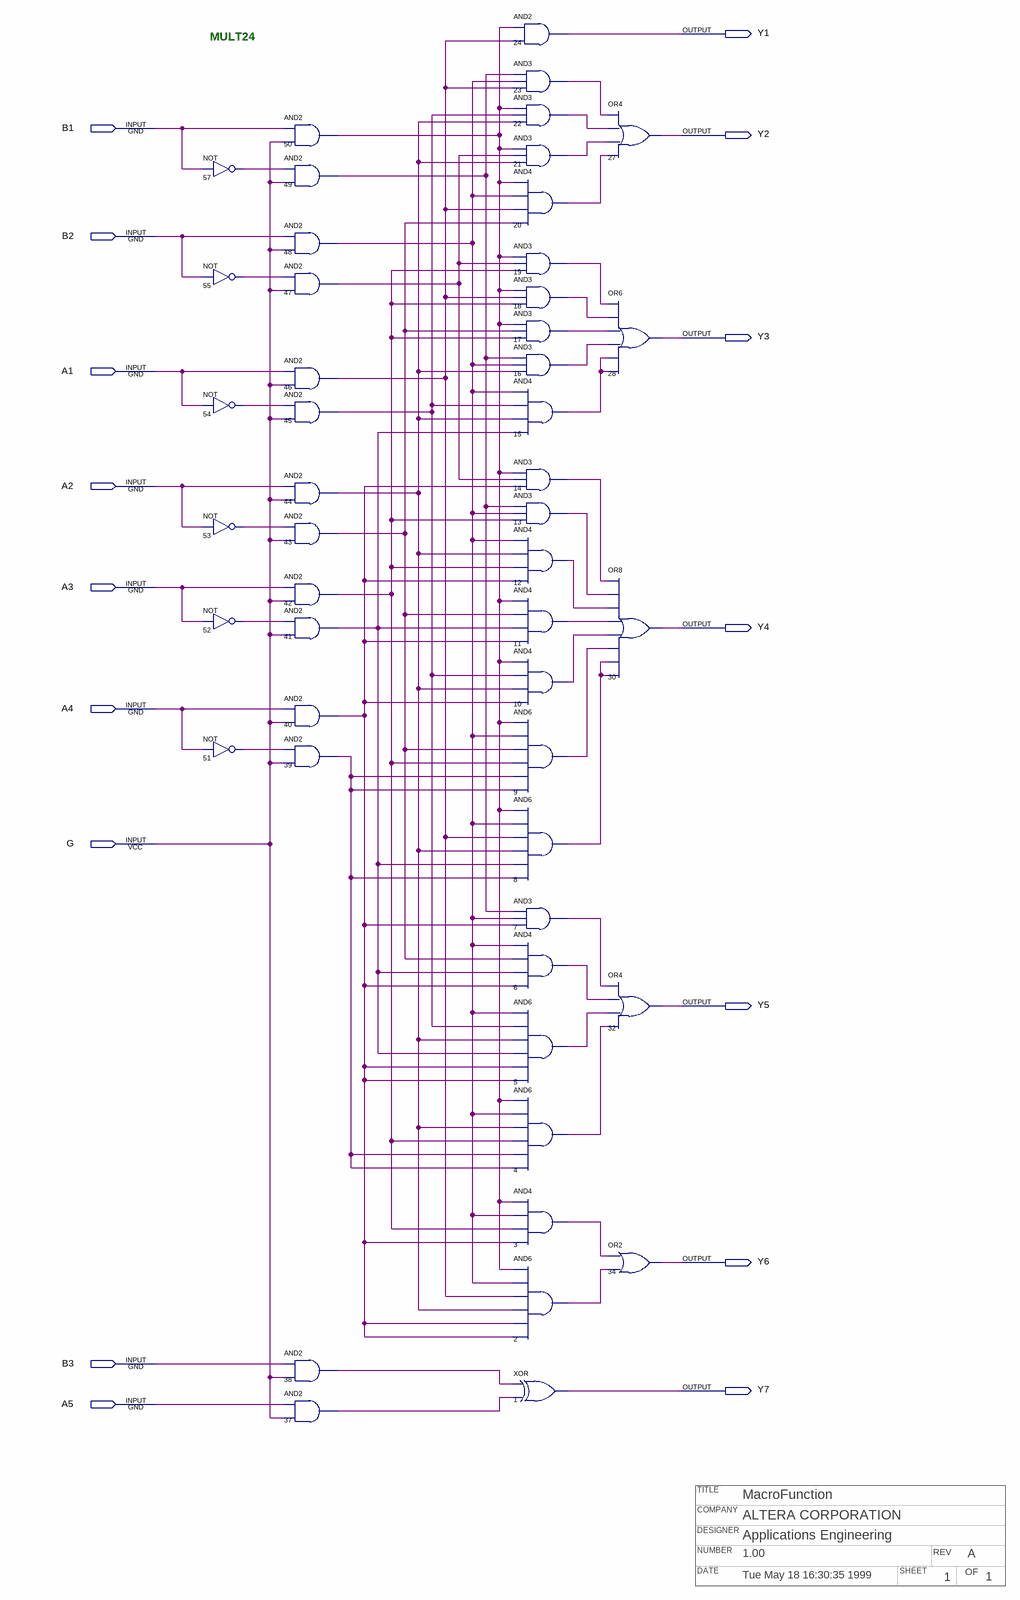
[diagram p0: schematic sheet]
// Quartus schematic mult24.bdf as structural Verilog: 49 symbols, 16 pins
// Title block: TITLE: MacroFunction; COMPANY: ALTERA CORPORATION; DESIGNER: Applications Engineering; NUMBER: 1.00; REV: A; DATE: Tue May 18 16:30:35 1999; SHEET: 1; OF: 1
module mult24 (
  input  B1,
  input  B2,
  input  A1,
  input  A2,
  input  A3,
  input  A4,
  input  G,
  input  B3,
  input  A5,
  output Y1,
  output Y2,
  output Y3,
  output Y4,
  output Y5,
  output Y6,
  output Y7
);

  wire n2_out, n3_out, n4_out, n5_out, n6_out, n7_out, n8_out, n9_out, n10_out, n11_out, n12_out, n13_out,
       n14_out, n15_out, n16_out, n17_out, n18_out, n19_out, n20_out, n21_out, n22_out, n23_out, n37_out,
       n38_out, n39_out, n40_out, n41_out, n42_out, n43_out, n44_out, n45_out, n46_out, n47_out, n48_out,
       n49_out, n50_out, n51_out, n52_out, n53_out, n54_out, n55_out, n57_out;

  not u_57 (n57_out, B1);
  not u_55 (n55_out, B2);
  not u_54 (n54_out, A1);
  not u_53 (n53_out, A2);
  not u_52 (n52_out, A3);
  not u_51 (n51_out, A4);
  and u_50 (n50_out, B1, G);
  and u_49 (n49_out, n57_out, G);
  and u_48 (n48_out, B2, G);
  and u_47 (n47_out, n55_out, G);
  and u_46 (n46_out, A1, G);
  and u_45 (n45_out, n54_out, G);
  and u_44 (n44_out, A2, G);
  and u_43 (n43_out, n53_out, G);
  and u_42 (n42_out, A3, G);
  and u_41 (n41_out, n52_out, G);
  and u_40 (n40_out, A4, G);
  and u_39 (n39_out, n51_out, G);
  and u_38 (n38_out, B3, G);
  and u_37 (n37_out, A5, G);
  and u_24 (Y1, n50_out, n46_out);
  and u_23 (n23_out, n49_out, n48_out, n46_out);
  and u_22 (n22_out, n50_out, n45_out, n44_out);
  and u_21 (n21_out, n50_out, n47_out, n44_out);
  and u_20 (n20_out, n50_out, n48_out, n46_out, n43_out);
  and u_19 (n19_out, n50_out, n47_out, n42_out);
  and u_18 (n18_out, n50_out, n46_out, n42_out);
  and u_17 (n17_out, n50_out, n43_out, n42_out);
  and u_16 (n16_out, n49_out, n48_out, n44_out);
  and u_15 (n15_out, n48_out, n45_out, n44_out, n41_out);
  and u_14 (n14_out, n50_out, n47_out, n40_out);
  and u_13 (n13_out, n49_out, n48_out, n42_out);
  and u_12 (n12_out, n48_out, n44_out, n42_out, n40_out);
  and u_11 (n11_out, n50_out, n43_out, n41_out, n40_out);
  and u_10 (n10_out, n50_out, n45_out, n44_out, n40_out);
  and u_9 (n9_out, n50_out, n48_out, n43_out, n42_out, n39_out, n39_out);
  and u_8 (n8_out, n50_out, n48_out, n46_out, n44_out, n41_out, n39_out);
  and u_7 (n7_out, n49_out, n48_out, n40_out);
  and u_6 (n6_out, n48_out, n43_out, n41_out, n40_out);
  and u_5 (n5_out, n48_out, n45_out, n44_out, n41_out, n40_out, n40_out);
  and u_4 (n4_out, n50_out, n48_out, n44_out, n42_out, n39_out, n39_out);
  and u_3 (n3_out, n50_out, n48_out, n42_out, n40_out);
  and u_2 (n2_out, n50_out, n48_out, n46_out, n44_out, n40_out, n40_out);
  xor u_1 (Y7, n38_out, n37_out);
  or u_27 (Y2, n23_out, n22_out, n21_out, n20_out);
  or u_28 (Y3, n19_out, n18_out, n17_out, n16_out, n15_out, n15_out);
  or u_30 (Y4, n14_out, n13_out, n12_out, n11_out, n10_out, n9_out, n8_out, n8_out);
  or u_32 (Y5, n7_out, n6_out, n5_out, n4_out);
  or u_34 (Y6, n3_out, n2_out);

  // Notes on the sheet:
  //   MULT24
endmodule
